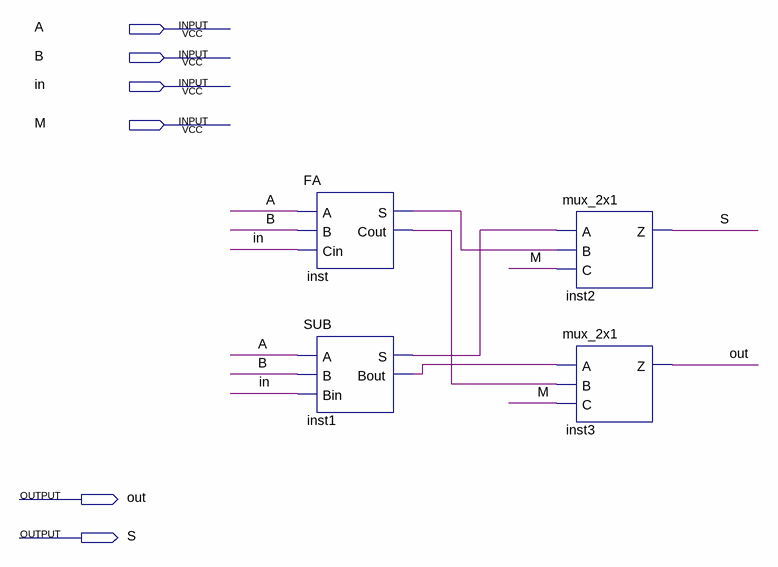
[diagram p0: schematic sheet]
// Quartus schematic HAS.bdf as structural Verilog: 4 symbols, 6 pins
module HAS (
  input  A,
  input  B,
  input  in,
  input  M,
  output out,
  output S
);

  wire inst1_bout, inst1_s, inst_cout, inst_s;

  FA inst (.A(A), .B(B), .Cin(in), .S(inst_s), .Cout(inst_cout));
  SUB inst1 (.A(A), .B(B), .Bin(in), .S(inst1_s), .Bout(inst1_bout));
  mux_2x1 inst2 (.A(inst1_s), .B(inst_s), .C(M), .Z(S));
  mux_2x1 inst3 (.A(inst1_bout), .B(inst_cout), .C(M), .Z(out));
endmodule
